# Altium schematic sheet Regelaar.SchDoc: Soldeerstation
size A4; DrawnBy: Sem Kirkels; DocumentNumber: 21P001S02; Revision: V1; SheetNumber: 2; SheetTotal: 5
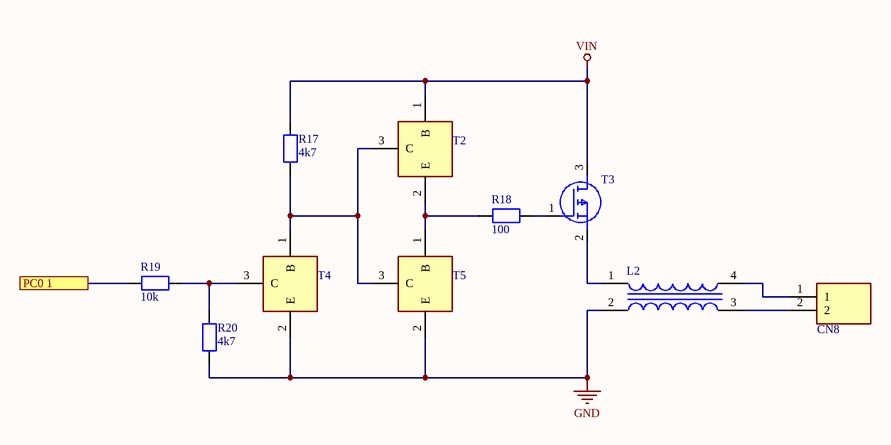
[diagram p0: Regelaar.SchDoc]

## Parts
CN8  282836-2  [2828362]  (value not drawn)
L2  Smoorspoel commom mode  [CM2545X171B10]  (value not drawn)
R17  4k7  [0805]
R18  100  [0805]
R19  10k  [0805]
R20  4k7  [0805]
T2  CMPT5551  [SOT95P230X109-3N]  (value not drawn)
T3  IRF9Z34NPBF  [TO254P469X1042X1967-3P]  (value not drawn)
T4  CMPT5551  [SOT95P230X109-3N]  (value not drawn)
T5  CMPT5551  [SOT95P230X109-3N]  (value not drawn)

## Ports
PC0 1

## Nets
GND: L2.2(SEC+) R20.1 T4.2(E) T5.2(E)
VIN: R17.2 T2.1(B) T3.3(D)
PC0 1: R19.1 ; port PC0 1
NetCN8_1: CN8.1 L2.4(PRI-)
NetCN8_2: CN8.2 L2.3(SEC-)
NetL2_1: L2.1(PRI+) T3.2(S)
NetR17_1: R17.1 T2.3(C) T4.1(B) T5.3(C)
NetR18_1: R18.1 T2.2(E) T5.1(B)
NetR18_2: R18.2 T3.1(G)
NetR19_2: R19.2 R20.2 T4.3(C)

## Library data of the parts
CN8 = Schroefconnector 2 Pin R: Connector; Manufacturer_Name: TE Connectivity; Datasheet Link: https://www.te.com/commerce/DocumentDelivery/DDEController?Action=showdoc&DocId=Customer+Drawing%7F282836%7FJ%7Fpdf%7FEnglish%7FENG_CD_282836_J.pdf%7F282836-2; Height: 10mm; Manufacturer_Part_Number: 282836-2
L2 = Smoorspoel commom mode: Transformer CM2545X171B-10; Manufacturer_Name: Laird Technologies; Datasheet Link: https://datasheet.datasheetarchive.com/originals/dk/DKDS-7/122753.pdf; Height: 9.5mm; Manufacturer_Part_Number: CM2545X171B-10
R17-R20 = Resistor 0805: Manufacturer: Vishay Dale; Part Number: CRCW08050000Z0EA
T2 T4 T5 = Transistor_L: Transistor; Manufacturer_Name: Central Semiconductor; Manufacturer_Part_Number: CMPT5551 TR PBFREE; Datasheet Link: https://my.centralsemi.com/datasheets/CMPT5551.PDF; Height: 1.09mm
T3 = IRF9Z34NPBF: MOSFET (P-Channel); Manufacturer_Name: Infineon; Datasheet Link: https://componentsearchengine.com//IRF9Z34NPBF.pdf; Height: 4.69mm; Mouser2 Part Number: 942-IRF9Z34NPBF; Mouser2 Price/Stock: https://www.mouser.com/Search/Refine.aspx?Keyword=942-IRF9Z34NPBF; Manufacturer_Part_Number: IRF9Z34NPBF